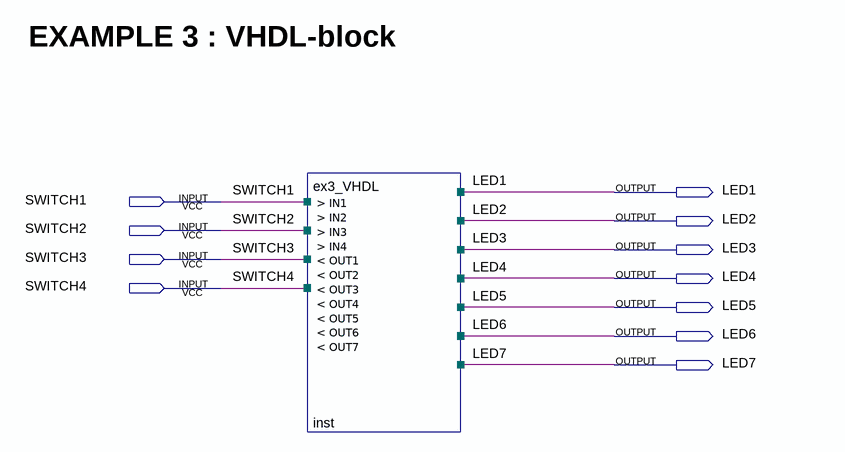
[diagram p0: schematic sheet]
// Quartus schematic ex3.bdf as structural Verilog: 1 symbols, 11 pins
module ex3 (
  input  SWITCH1,
  input  SWITCH2,
  input  SWITCH3,
  input  SWITCH4,
  output LED1,
  output LED2,
  output LED3,
  output LED4,
  output LED5,
  output LED6,
  output LED7
);

  ex3_VHDL inst (
    .IN1(SWITCH1), .IN2(SWITCH2), .IN3(SWITCH3), .IN4(SWITCH4), .OUT1(LED1), .OUT2(LED2), .OUT3(LED3),
    .OUT4(LED4), .OUT5(LED5), .OUT6(LED6), .OUT7(LED7));

  // Notes on the sheet:
  //   EXAMPLE 3 : VHDL-block
endmodule
